# Altium schematic sheet 1-Connectors.SchDoc
size A4
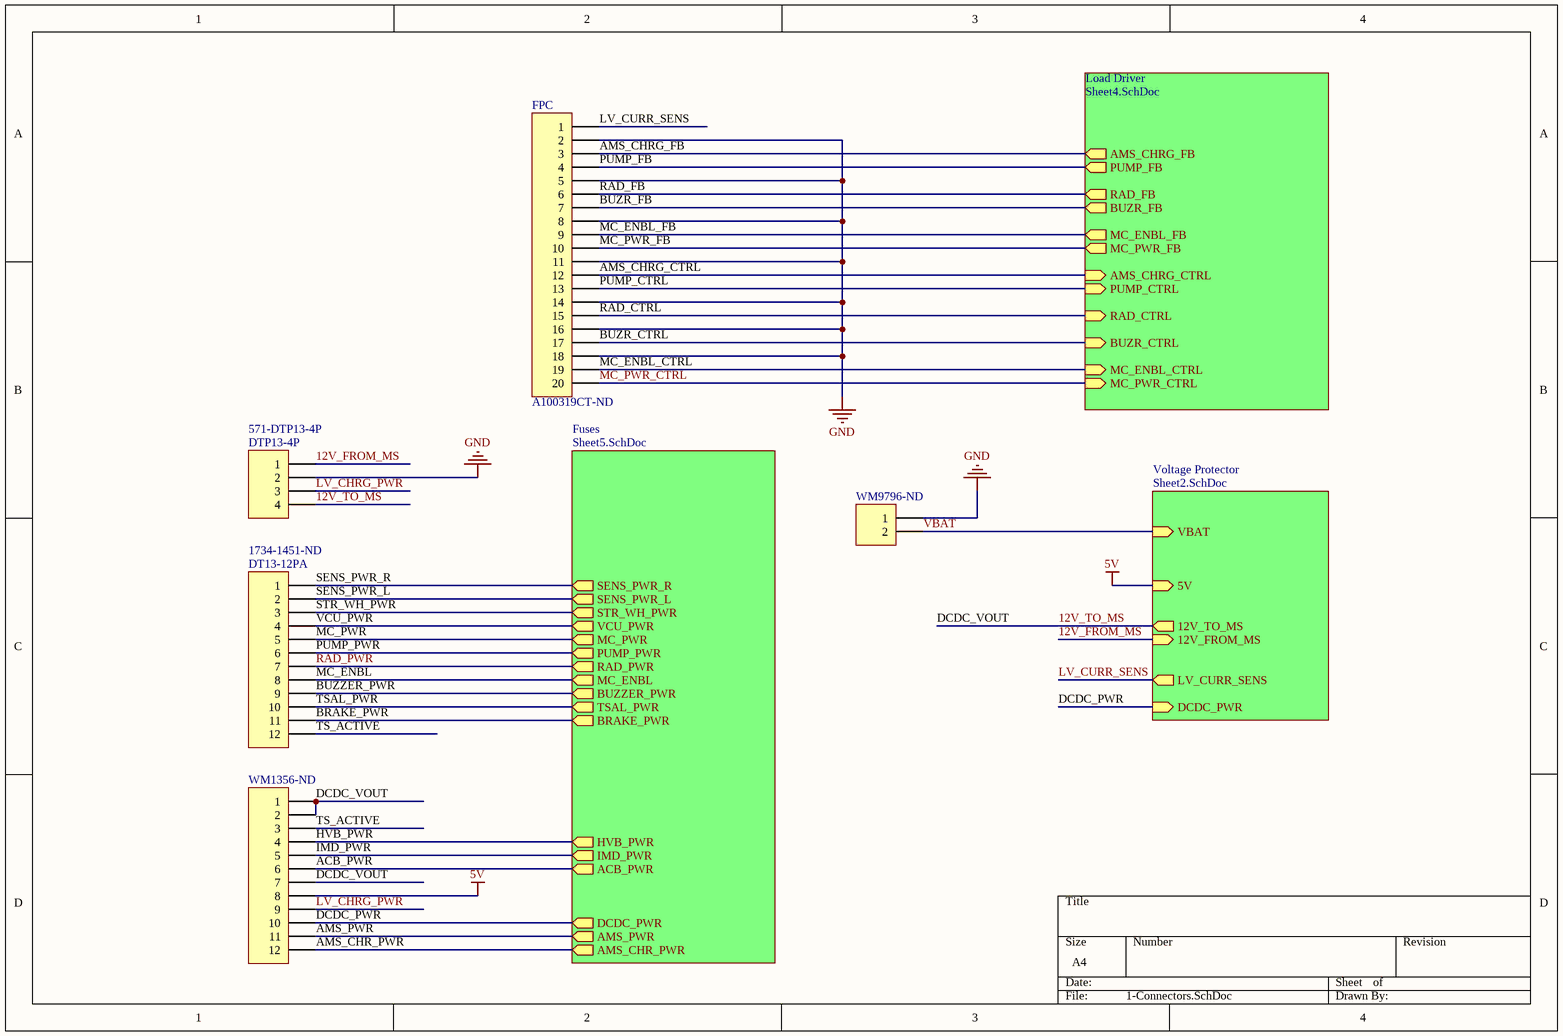
[diagram p0: 1-Connectors.SchDoc]

## Parts
DT13-12PA  Supplier Part Number 2: 1734-1451-ND  [DT13-12PA]  (hidden comment: DT13-12PA)
DTP13-4P  Supplier Part Number 1: 571-DTP13-4P  [DTP13-4P]  (hidden comment: DTP13-4P)
FPC  Header 20  [A100319CT-ND]  (value not drawn)
WM1356-ND  Header 12  [WM1356-ND]  (value not drawn)
WM9796-ND  WM9796-ND  [WM9796-ND]  (value not drawn)

## Sub-sheets
Fuses = Sheet5.SchDoc: MC_ENBL (out), MC_PWR (out), VCU_PWR (out), BRAKE_PWR (out), BUZZER_PWR (out), TSAL_PWR (out), PUMP_PWR (out), ACB_PWR (out), IMD_PWR (out), AMS_CHR_PWR (out), HVB_PWR (out), AMS_PWR (out), STR_WH_PWR (out), SENS_PWR_L (out), SENS_PWR_R (out), RAD_PWR (out), DCDC_PWR (out)
Load Driver = Sheet4.SchDoc: RAD_CTRL (in), PUMP_CTRL (in), BUZR_FB (out), RAD_FB (out), AMS_CHRG_FB (out), PUMP_FB (out), MC_PWR_FB (out), MC_ENBL_FB (out), BUZR_CTRL (in), MC_ENBL_CTRL (in), AMS_CHRG_CTRL (in), MC_PWR_CTRL (in)
Voltage Protector = Sheet2.SchDoc: 12V_TO_MS (out), LV_CURR_SENS (out), 5V (in), 12V_FROM_MS (in), VBAT (in), DCDC_PWR (in)

## Nets
5V: WM1356-ND.8 ; sheet Voltage Protector/5V
GND: DTP13-4P.2 FPC.2 FPC.5 FPC.8 FPC.11 FPC.14 FPC.16 FPC.18 WM9796-ND.1
12V_FROM_MS: DTP13-4P.1 ; sheet Voltage Protector/12V_FROM_MS
12V_TO_MS: DTP13-4P.4 WM1356-ND.1 WM1356-ND.2 WM1356-ND.7 ; sheet Voltage Protector/12V_TO_MS  [also labelled DCDC_VOUT]
ACB_PWR: WM1356-ND.6 ; sheet Fuses/ACB_PWR
AMS_CHR_PWR: WM1356-ND.12 ; sheet Fuses/AMS_CHR_PWR
AMS_CHRG_CTRL: FPC.12 ; sheet Load Driver/AMS_CHRG_CTRL
AMS_CHRG_FB: FPC.3 ; sheet Load Driver/AMS_CHRG_FB
AMS_PWR: WM1356-ND.11 ; sheet Fuses/AMS_PWR
BRAKE_PWR: DT13-12PA.11 ; sheet Fuses/BRAKE_PWR
BUZR_CTRL: FPC.17 ; sheet Load Driver/BUZR_CTRL
BUZR_FB: FPC.7 ; sheet Load Driver/BUZR_FB
BUZZER_PWR: DT13-12PA.9 ; sheet Fuses/BUZZER_PWR
DCDC_PWR: WM1356-ND.10 ; sheet Voltage Protector/DCDC_PWR, sheet Fuses/DCDC_PWR
HVB_PWR: WM1356-ND.4 ; sheet Fuses/HVB_PWR
IMD_PWR: WM1356-ND.5 ; sheet Fuses/IMD_PWR
LV_CHRG_PWR: DTP13-4P.3 WM1356-ND.9
LV_CURR_SENS: FPC.1 ; sheet Voltage Protector/LV_CURR_SENS
MC_ENBL: DT13-12PA.8 ; sheet Fuses/MC_ENBL
MC_ENBL_CTRL: FPC.19 ; sheet Load Driver/MC_ENBL_CTRL
MC_ENBL_FB: FPC.9 ; sheet Load Driver/MC_ENBL_FB
MC_PWR: DT13-12PA.5 ; sheet Fuses/MC_PWR
MC_PWR_CTRL: FPC.20 ; sheet Load Driver/MC_PWR_CTRL
MC_PWR_FB: FPC.10 ; sheet Load Driver/MC_PWR_FB
PUMP_CTRL: FPC.13 ; sheet Load Driver/PUMP_CTRL
PUMP_FB: FPC.4 ; sheet Load Driver/PUMP_FB
PUMP_PWR: DT13-12PA.6 ; sheet Fuses/PUMP_PWR
RAD_CTRL: FPC.15 ; sheet Load Driver/RAD_CTRL
RAD_FB: FPC.6 ; sheet Load Driver/RAD_FB
RAD_PWR: DT13-12PA.7 ; sheet Fuses/RAD_PWR
SENS_PWR_L: DT13-12PA.2 ; sheet Fuses/SENS_PWR_L
SENS_PWR_R: DT13-12PA.1 ; sheet Fuses/SENS_PWR_R
STR_WH_PWR: DT13-12PA.3 ; sheet Fuses/STR_WH_PWR
TS_ACTIVE: DT13-12PA.12 WM1356-ND.3
TSAL_PWR: DT13-12PA.10 ; sheet Fuses/TSAL_PWR
VBAT: WM9796-ND.2 ; sheet Voltage Protector/VBAT
VCU_PWR: DT13-12PA.4 ; sheet Fuses/VCU_PWR

## Library data of the parts
DT13-12PA WM1356-ND = Header 12: Header, 12-Pin; LatestRevisionDate: 17-Jul-2002; LatestRevisionNote: Re-released for DXP Platform.; Publisher: Altium Limited; Supplier 1: Digi-Key
  DT13-12PA: Supplier Part Number 1: DT13-12PA; Supplier 2: Digi-Key
  WM1356-ND: Supplier Part Number 1: WM1356-ND
DTP13-4P = Header 4: Header, 4-Pin; LatestRevisionDate: 17-Jul-2002; LatestRevisionNote: Re-released for DXP Platform.; Publisher: Altium Limited; Supplier 1: Mouser
FPC = Header 20: Header, 20-Pin; LatestRevisionDate: 17-Jul-2002; LatestRevisionNote: Re-released for DXP Platform.; Publisher: Altium Limited; Supplier 1: Digi-Key; Supplier Part Number 1: A100319CT-ND
WM9796-ND = Header 2: Header, 2-Pin; LatestRevisionDate: 17-Jul-2002; LatestRevisionNote: Re-released for DXP Platform.; Publisher: Altium Limited; Supplier 1: Digi-Key; Supplier 2: Digi-Key; Supplier Part Number 2: WM9796-ND